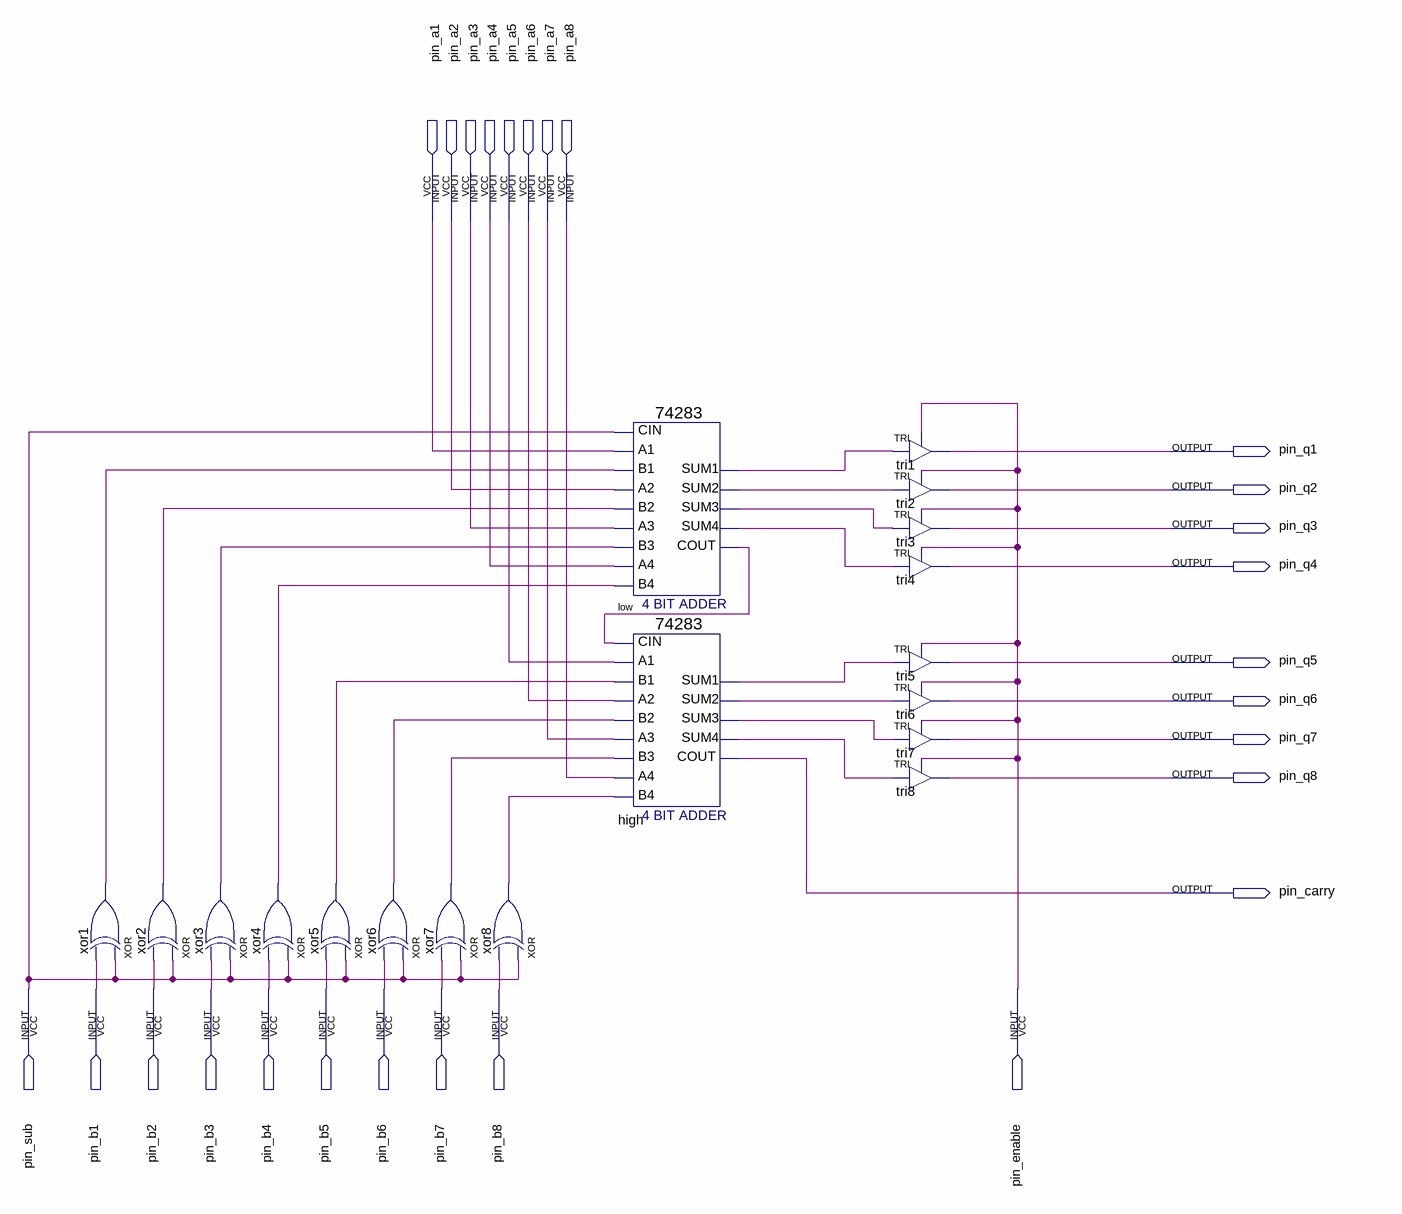
[diagram p0: schematic sheet]
// Quartus schematic 8bitalu.bdf as structural Verilog: 18 symbols, 27 pins
module \8bitalu  (
  input  pin_a1,
  input  pin_a2,
  input  pin_a3,
  input  pin_a4,
  input  pin_a5,
  input  pin_a6,
  input  pin_a7,
  input  pin_a8,
  input  pin_sub,
  input  pin_b1,
  input  pin_b2,
  input  pin_b3,
  input  pin_b4,
  input  pin_b5,
  input  pin_b6,
  input  pin_b7,
  input  pin_b8,
  input  pin_enable,
  output pin_q1,
  output pin_q2,
  output pin_q3,
  output pin_q4,
  output pin_q5,
  output pin_q6,
  output pin_q7,
  output pin_q8,
  output pin_carry
);

  wire high_sum1, high_sum2, high_sum3, high_sum4, low_cout, low_sum1, low_sum2, low_sum3, low_sum4,
       xor1_out, xor2_out, xor3_out, xor4_out, xor5_out, xor6_out, xor7_out, xor8_out;

  xor xor1 (xor1_out, pin_sub, pin_b1);
  xor xor2 (xor2_out, pin_sub, pin_b2);
  xor xor3 (xor3_out, pin_sub, pin_b3);
  xor xor4 (xor4_out, pin_sub, pin_b4);
  xor xor5 (xor5_out, pin_sub, pin_b5);
  xor xor6 (xor6_out, pin_sub, pin_b6);
  xor xor7 (xor7_out, pin_sub, pin_b7);
  xor xor8 (xor8_out, pin_sub, pin_b8);
  \74283  low (
    .CIN(pin_sub), .A1(pin_a1), .A2(pin_a2), .B2(xor2_out), .A3(pin_a3), .A4(pin_a4), .B4(xor4_out),
    .B1(xor1_out), .B3(xor3_out), .SUM4(low_sum4), .COUT(low_cout), .SUM1(low_sum1), .SUM2(low_sum2),
    .SUM3(low_sum3));
  \74283  high (
    .CIN(low_cout), .A1(pin_a5), .A2(pin_a6), .B2(xor6_out), .A3(pin_a7), .A4(pin_a8), .B4(xor8_out),
    .B1(xor5_out), .B3(xor7_out), .SUM4(high_sum4), .COUT(pin_carry), .SUM1(high_sum1), .SUM2(high_sum2),
    .SUM3(high_sum3));
  TRI \tri1  (.IN(low_sum1), .OE(pin_enable), .OUT(pin_q1));
  TRI tri2 (.IN(low_sum2), .OE(pin_enable), .OUT(pin_q2));
  TRI tri3 (.IN(low_sum3), .OE(pin_enable), .OUT(pin_q3));
  TRI tri4 (.IN(low_sum4), .OE(pin_enable), .OUT(pin_q4));
  TRI tri5 (.IN(high_sum1), .OE(pin_enable), .OUT(pin_q5));
  TRI tri6 (.IN(high_sum2), .OE(pin_enable), .OUT(pin_q6));
  TRI tri7 (.IN(high_sum3), .OE(pin_enable), .OUT(pin_q7));
  TRI tri8 (.IN(high_sum4), .OE(pin_enable), .OUT(pin_q8));
endmodule
